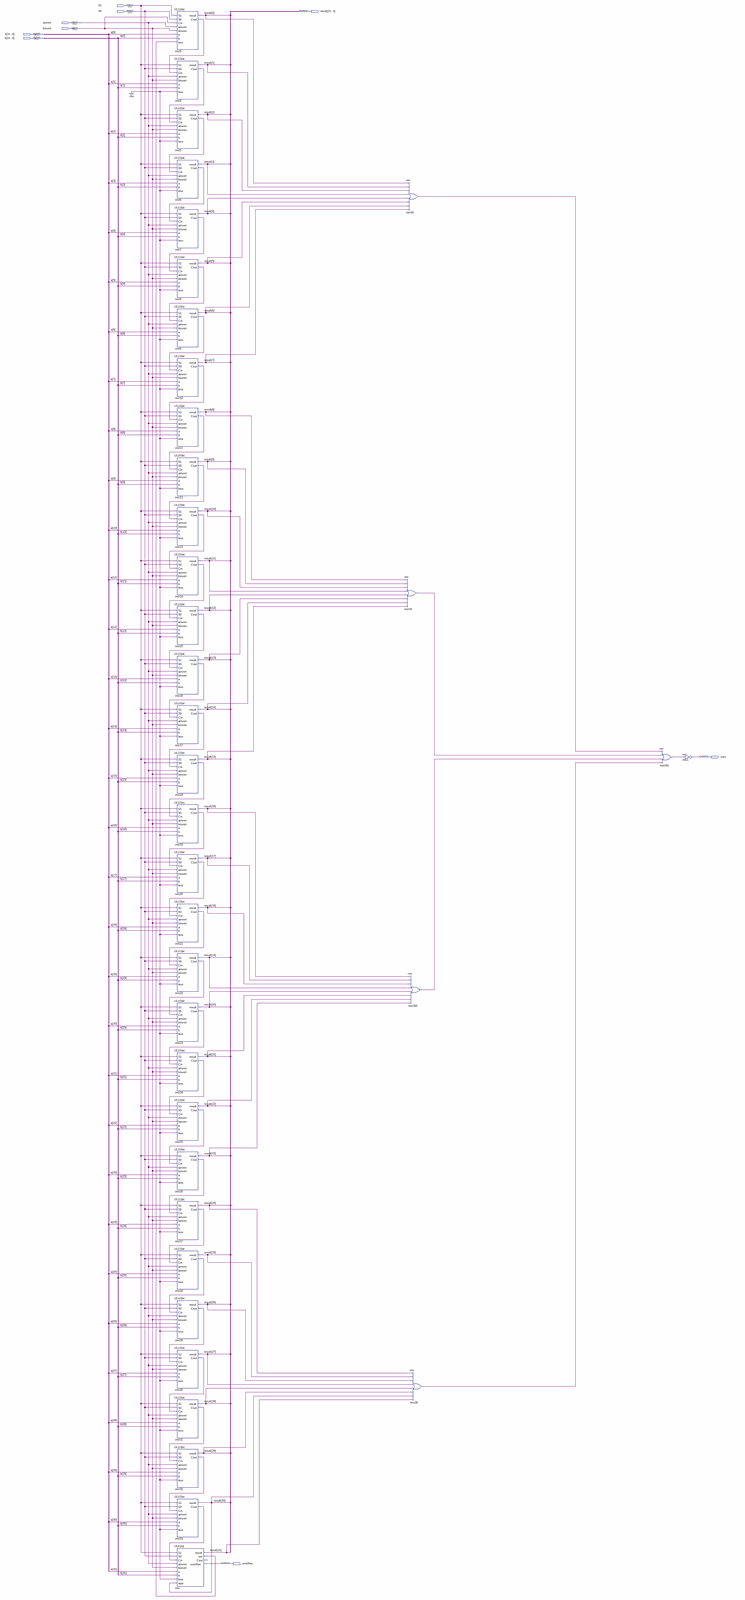
[diagram p0: schematic sheet, whole]
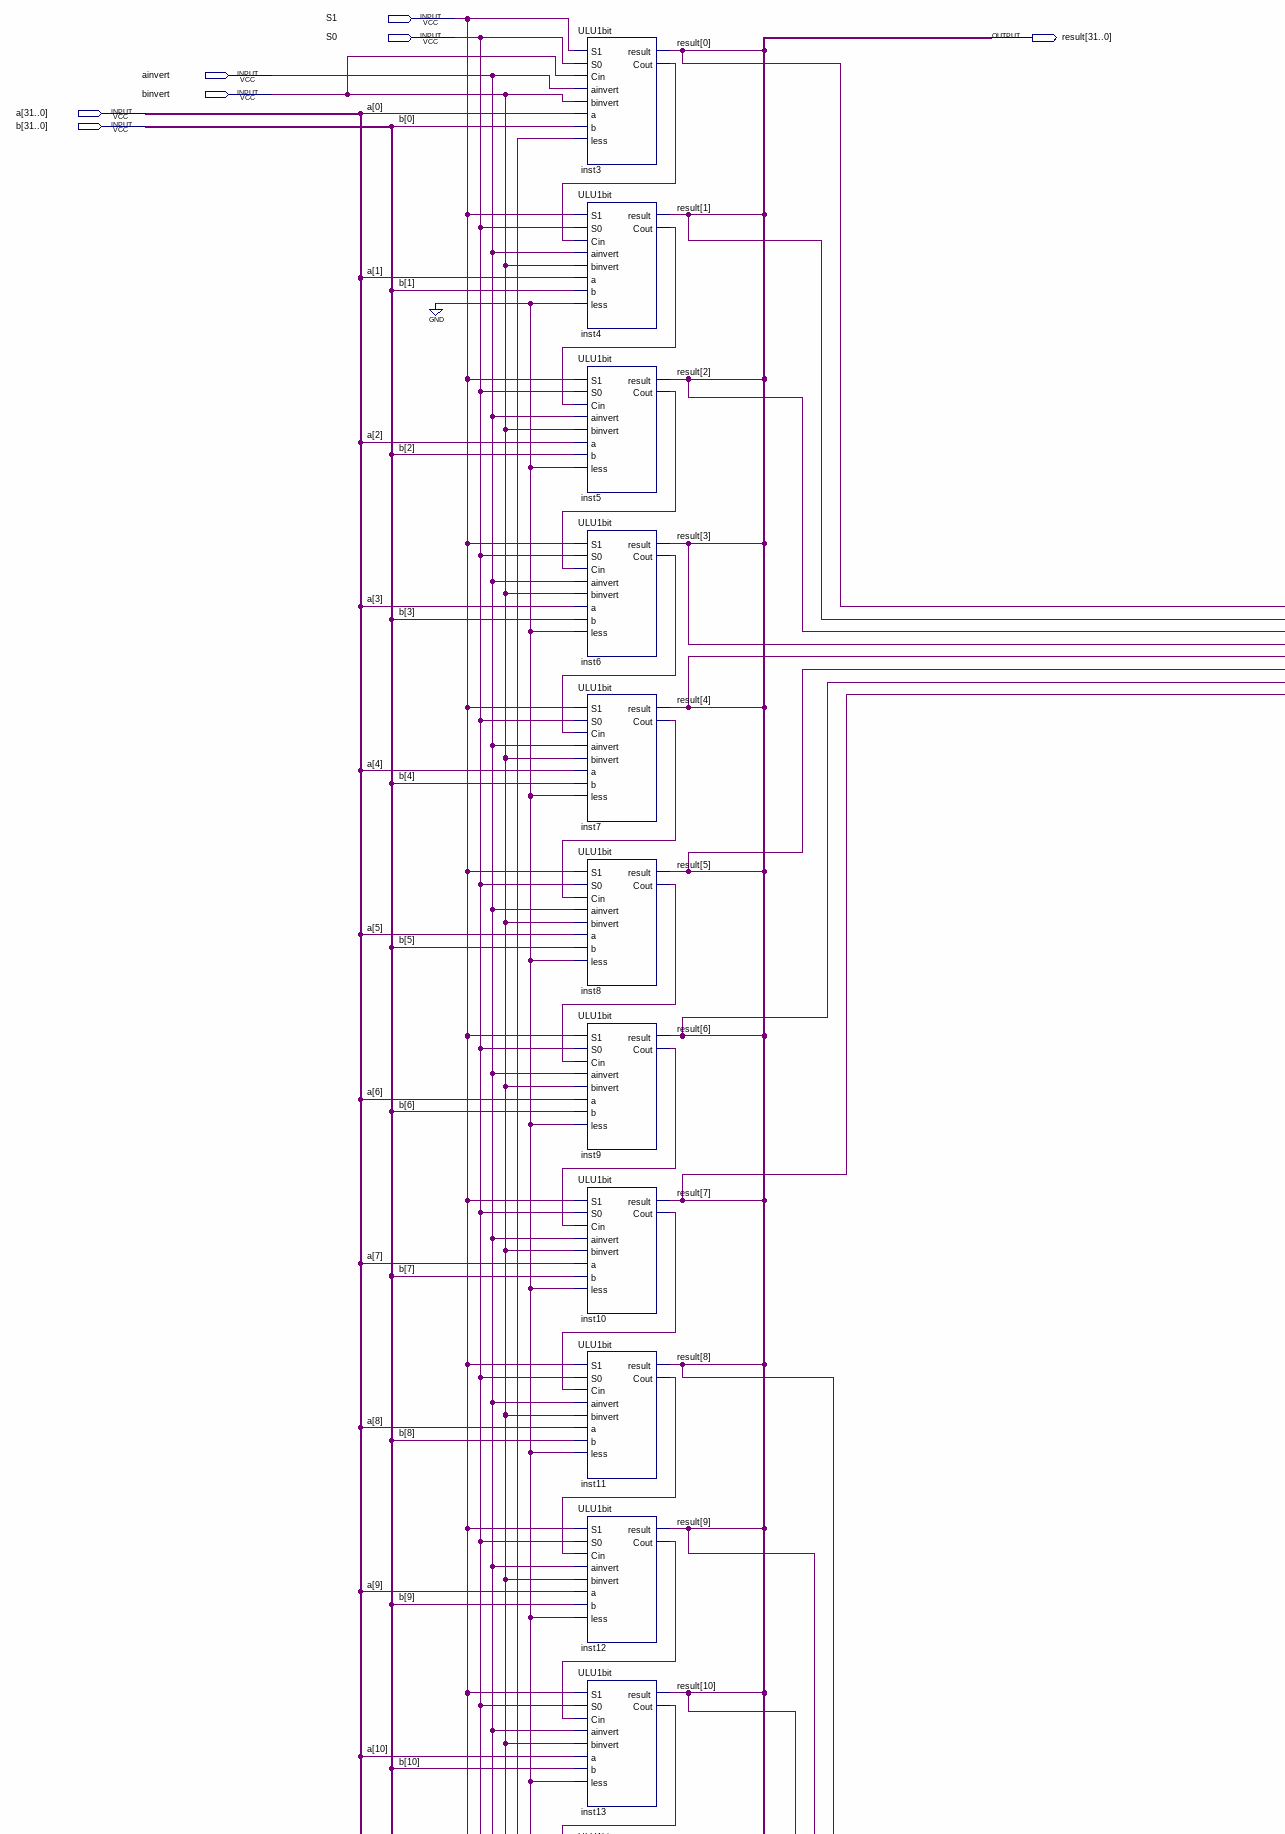
[diagram p1: schematic sheet, upper left part]
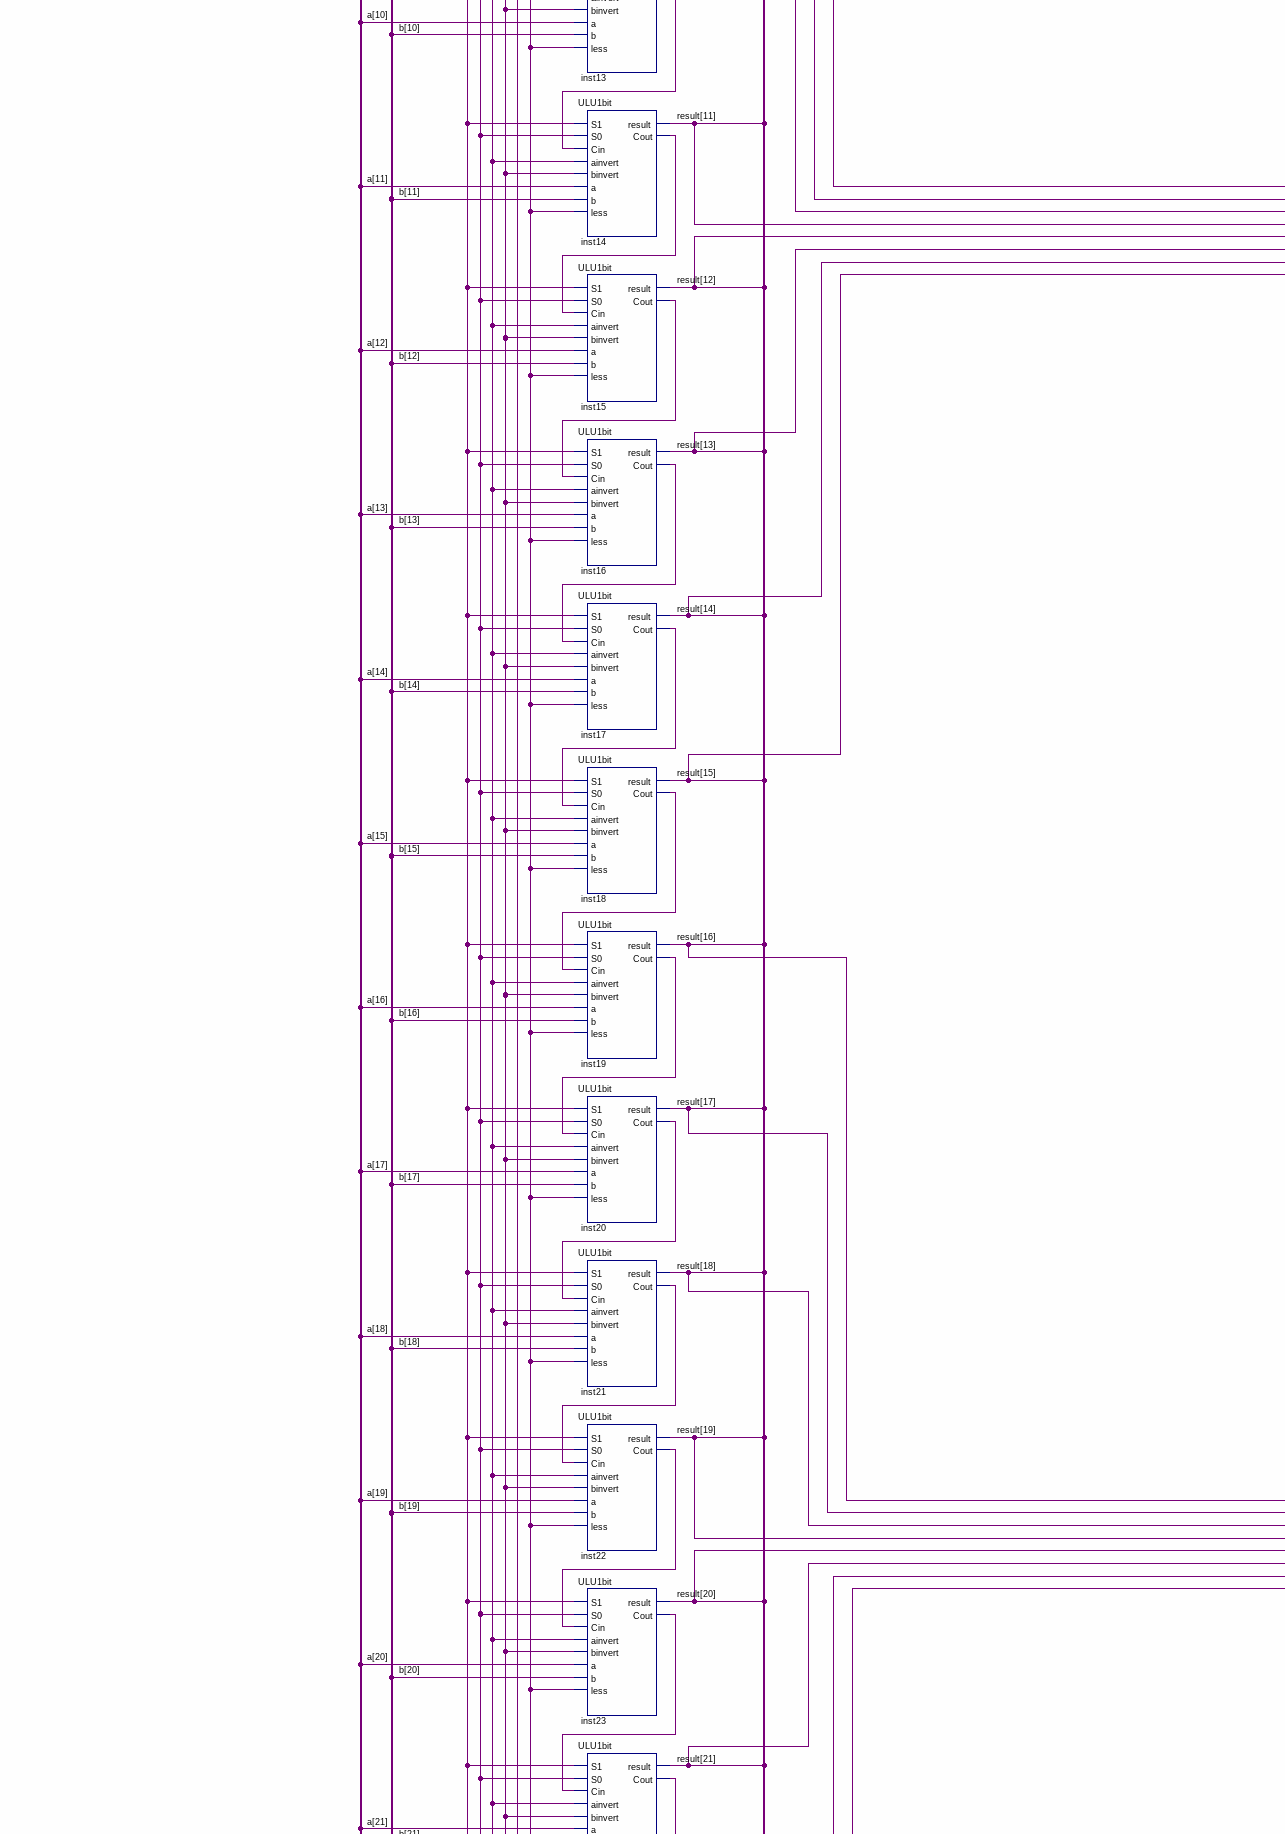
[diagram p2: schematic sheet, middle left part]
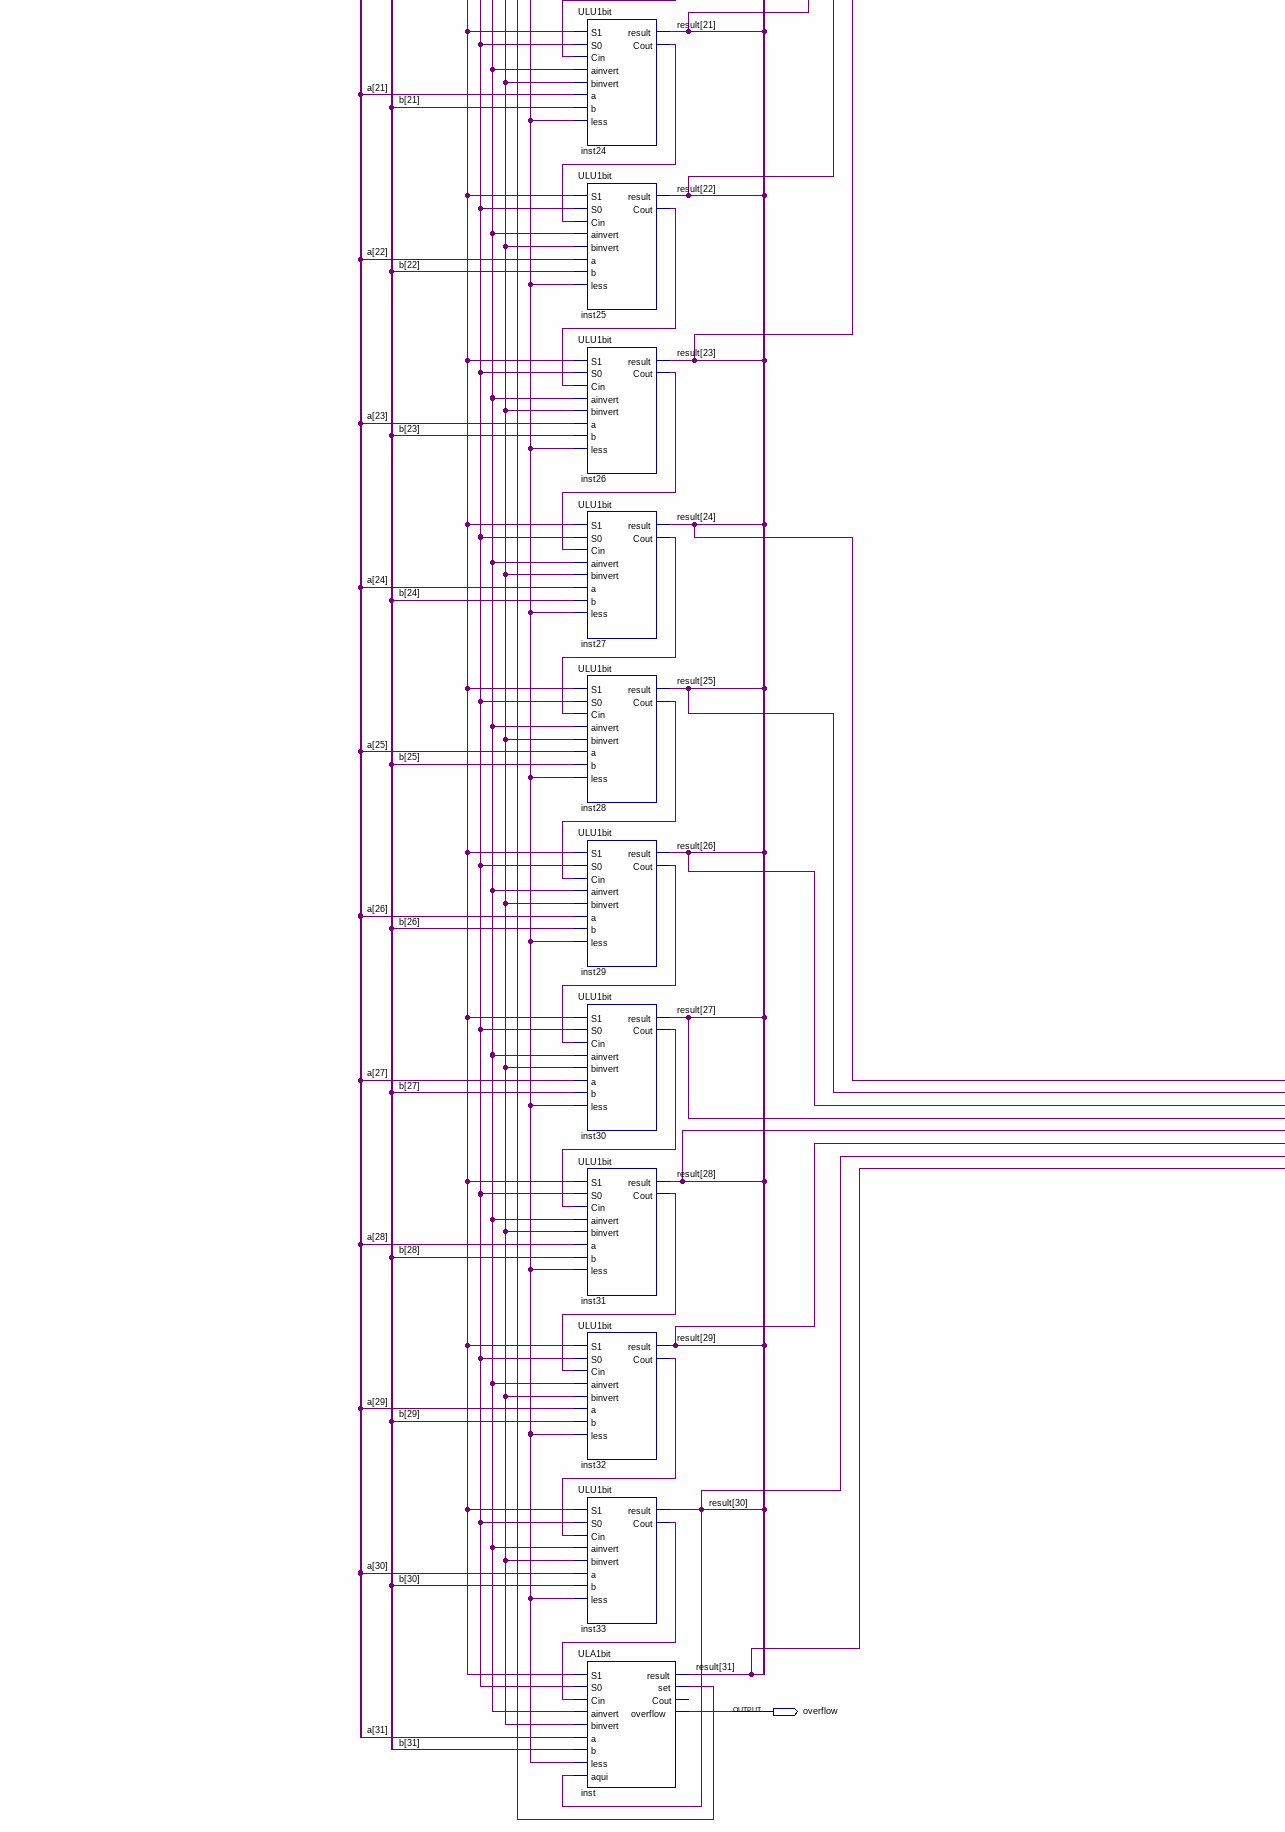
[diagram p3: schematic sheet, lower left part]
// Quartus schematic ULA32bits.bdf as structural Verilog: 38 symbols, 9 pins
module ULA32bits (
  input  S1,
  input  S0,
  input  ainvert,
  input  binvert,
  input  [31:0] a,
  input  [31:0] b,
  output [31:0] result,
  output zero,
  output overflow
);

  wire inst3_cout, inst4_cout, inst5_cout, inst6_cout, inst7_cout, inst8_cout, inst9_cout, inst10_cout,
       inst11_cout, inst12_cout, inst13_cout, inst14_cout, inst15_cout, inst16_cout, inst17_cout,
       inst18_cout, inst19_cout, inst20_cout, inst21_cout, inst22_cout, inst23_cout, inst24_cout,
       inst25_cout, inst26_cout, inst27_cout, inst28_cout, inst29_cout, inst30_cout, inst31_cout,
       inst32_cout, inst33_cout, inst38_out, inst39_out, inst40_out, inst391_out, inst392_out, inst_set;

  ULU1bit inst3 (
    .S1(S1), .S0(S0), .Cin(binvert), .ainvert(ainvert), .binvert(binvert), .a(a[0]), .b(b[0]),
    .less(inst_set), .result(result[0]), .Cout(inst3_cout));
  ULU1bit inst4 (
    .S1(S1), .S0(S0), .Cin(inst3_cout), .ainvert(ainvert), .binvert(binvert), .a(a[1]), .b(b[1]),
    .less(1'b0), .result(result[1]), .Cout(inst4_cout));
  ULU1bit inst5 (
    .S1(S1), .S0(S0), .Cin(inst4_cout), .ainvert(ainvert), .binvert(binvert), .a(a[2]), .b(b[2]),
    .less(1'b0), .result(result[2]), .Cout(inst5_cout));
  ULU1bit inst6 (
    .S1(S1), .S0(S0), .Cin(inst5_cout), .ainvert(ainvert), .binvert(binvert), .a(a[3]), .b(b[3]),
    .less(1'b0), .result(result[3]), .Cout(inst6_cout));
  ULU1bit inst7 (
    .S1(S1), .S0(S0), .Cin(inst6_cout), .ainvert(ainvert), .binvert(binvert), .a(a[4]), .b(b[4]),
    .less(1'b0), .result(result[4]), .Cout(inst7_cout));
  ULU1bit inst8 (
    .S1(S1), .S0(S0), .Cin(inst7_cout), .ainvert(ainvert), .binvert(binvert), .a(a[5]), .b(b[5]),
    .less(1'b0), .result(result[5]), .Cout(inst8_cout));
  ULU1bit inst9 (
    .S1(S1), .S0(S0), .Cin(inst8_cout), .ainvert(ainvert), .binvert(binvert), .a(a[6]), .b(b[6]),
    .less(1'b0), .result(result[6]), .Cout(inst9_cout));
  ULU1bit inst10 (
    .S1(S1), .S0(S0), .Cin(inst9_cout), .ainvert(ainvert), .binvert(binvert), .a(a[7]), .b(b[7]),
    .less(1'b0), .result(result[7]), .Cout(inst10_cout));
  ULU1bit inst11 (
    .S1(S1), .S0(S0), .Cin(inst10_cout), .ainvert(ainvert), .binvert(binvert), .a(a[8]), .b(b[8]),
    .less(1'b0), .result(result[8]), .Cout(inst11_cout));
  ULU1bit inst12 (
    .S1(S1), .S0(S0), .Cin(inst11_cout), .ainvert(ainvert), .binvert(binvert), .a(a[9]), .b(b[9]),
    .less(1'b0), .result(result[9]), .Cout(inst12_cout));
  ULU1bit inst13 (
    .S1(S1), .S0(S0), .Cin(inst12_cout), .ainvert(ainvert), .binvert(binvert), .a(a[10]), .b(b[10]),
    .less(1'b0), .result(result[10]), .Cout(inst13_cout));
  ULU1bit inst14 (
    .S1(S1), .S0(S0), .Cin(inst13_cout), .ainvert(ainvert), .binvert(binvert), .a(a[11]), .b(b[11]),
    .less(1'b0), .result(result[11]), .Cout(inst14_cout));
  ULU1bit inst15 (
    .S1(S1), .S0(S0), .Cin(inst14_cout), .ainvert(ainvert), .binvert(binvert), .a(a[12]), .b(b[12]),
    .less(1'b0), .result(result[12]), .Cout(inst15_cout));
  ULU1bit inst16 (
    .S1(S1), .S0(S0), .Cin(inst15_cout), .ainvert(ainvert), .binvert(binvert), .a(a[13]), .b(b[13]),
    .less(1'b0), .result(result[13]), .Cout(inst16_cout));
  ULU1bit inst17 (
    .S1(S1), .S0(S0), .Cin(inst16_cout), .ainvert(ainvert), .binvert(binvert), .a(a[14]), .b(b[14]),
    .less(1'b0), .result(result[14]), .Cout(inst17_cout));
  ULU1bit inst18 (
    .S1(S1), .S0(S0), .Cin(inst17_cout), .ainvert(ainvert), .binvert(binvert), .a(a[15]), .b(b[15]),
    .less(1'b0), .result(result[15]), .Cout(inst18_cout));
  ULU1bit inst19 (
    .S1(S1), .S0(S0), .Cin(inst18_cout), .ainvert(ainvert), .binvert(binvert), .a(a[16]), .b(b[16]),
    .less(1'b0), .result(result[16]), .Cout(inst19_cout));
  ULU1bit inst20 (
    .S1(S1), .S0(S0), .Cin(inst19_cout), .ainvert(ainvert), .binvert(binvert), .a(a[17]), .b(b[17]),
    .less(1'b0), .result(result[17]), .Cout(inst20_cout));
  ULU1bit inst21 (
    .S1(S1), .S0(S0), .Cin(inst20_cout), .ainvert(ainvert), .binvert(binvert), .a(a[18]), .b(b[18]),
    .less(1'b0), .result(result[18]), .Cout(inst21_cout));
  ULU1bit inst22 (
    .S1(S1), .S0(S0), .Cin(inst21_cout), .ainvert(ainvert), .binvert(binvert), .a(a[19]), .b(b[19]),
    .less(1'b0), .result(result[19]), .Cout(inst22_cout));
  ULU1bit inst23 (
    .S1(S1), .S0(S0), .Cin(inst22_cout), .ainvert(ainvert), .binvert(binvert), .a(a[20]), .b(b[20]),
    .less(1'b0), .result(result[20]), .Cout(inst23_cout));
  ULU1bit inst24 (
    .S1(S1), .S0(S0), .Cin(inst23_cout), .ainvert(ainvert), .binvert(binvert), .a(a[21]), .b(b[21]),
    .less(1'b0), .result(result[21]), .Cout(inst24_cout));
  ULU1bit inst25 (
    .S1(S1), .S0(S0), .Cin(inst24_cout), .ainvert(ainvert), .binvert(binvert), .a(a[22]), .b(b[22]),
    .less(1'b0), .result(result[22]), .Cout(inst25_cout));
  ULU1bit inst26 (
    .S1(S1), .S0(S0), .Cin(inst25_cout), .ainvert(ainvert), .binvert(binvert), .a(a[23]), .b(b[23]),
    .less(1'b0), .result(result[23]), .Cout(inst26_cout));
  ULU1bit inst27 (
    .S1(S1), .S0(S0), .Cin(inst26_cout), .ainvert(ainvert), .binvert(binvert), .a(a[24]), .b(b[24]),
    .less(1'b0), .result(result[24]), .Cout(inst27_cout));
  ULU1bit inst28 (
    .S1(S1), .S0(S0), .Cin(inst27_cout), .ainvert(ainvert), .binvert(binvert), .a(a[25]), .b(b[25]),
    .less(1'b0), .result(result[25]), .Cout(inst28_cout));
  ULU1bit inst29 (
    .S1(S1), .S0(S0), .Cin(inst28_cout), .ainvert(ainvert), .binvert(binvert), .a(a[26]), .b(b[26]),
    .less(1'b0), .result(result[26]), .Cout(inst29_cout));
  ULU1bit inst30 (
    .S1(S1), .S0(S0), .Cin(inst29_cout), .ainvert(ainvert), .binvert(binvert), .a(a[27]), .b(b[27]),
    .less(1'b0), .result(result[27]), .Cout(inst30_cout));
  ULU1bit inst31 (
    .S1(S1), .S0(S0), .Cin(inst30_cout), .ainvert(ainvert), .binvert(binvert), .a(a[28]), .b(b[28]),
    .less(1'b0), .result(result[28]), .Cout(inst31_cout));
  ULU1bit inst32 (
    .S1(S1), .S0(S0), .Cin(inst31_cout), .ainvert(ainvert), .binvert(binvert), .a(a[29]), .b(b[29]),
    .less(1'b0), .result(result[29]), .Cout(inst32_cout));
  ULU1bit inst33 (
    .S1(S1), .S0(S0), .Cin(inst32_cout), .ainvert(ainvert), .binvert(binvert), .a(a[30]), .b(b[30]),
    .less(1'b0), .result(result[30]), .Cout(inst33_cout));
  ULA1bit inst (
    .S1(S1), .S0(S0), .Cin(inst33_cout), .ainvert(ainvert), .binvert(binvert), .a(a[31]), .b(b[31]),
    .less(1'b0), .aqui(result[30]), .result(result[31]), .set(inst_set), .overflow(overflow));  // open: Cout
  or inst40 (inst40_out, result[0], result[1], result[2], result[3], result[4], result[5], result[6], result[7]);
  or inst39 (inst39_out, result[8], result[9], result[10], result[11], result[12], result[13], result[14], result[15]);
  or inst392 (inst392_out, result[16], result[17], result[18], result[19], result[20], result[21], result[22], result[23]);
  or inst38 (inst38_out, result[24], result[25], result[26], result[27], result[28], result[29], result[30], result[31]);
  or inst391 (inst391_out, inst40_out, inst39_out, inst392_out, inst38_out);
  not inst1 (zero, inst391_out);
endmodule
